# Altium schematic sheet SmartDevice.SchDoc
size A
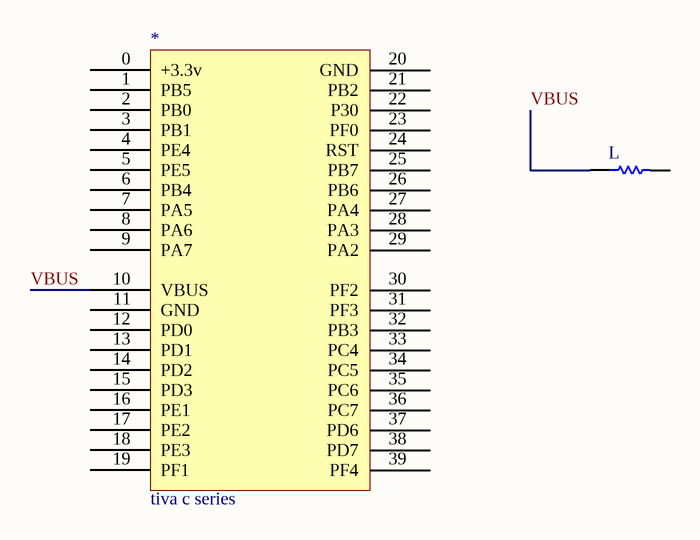
[diagram p0: SmartDevice.SchDoc]

## Parts
*  tiva c series
L  RESISTOR  [RES 1/2W]  (value not drawn)

## Nets
VBUS: *.10(VBUS) L.1

Not connected (* = marked no-connect by the designer): * 0(+3.3v) 1(PB5) 2(PB0) 3(PB1) 4(PE4) 5(PE5) 6(PB4) 7(PA5) 8(PA6) 9(PA7) 11(GND) 12(PD0) 13(PD1) 14(PD2) 15(PD3) 16(PE1) 17(PE2) 18(PE3) 19(PF1) 20(GND) 21(PB2) 22(P30) 23(PF0) 24(RST) 25(PB7) 26(PB6) 27(PA4) 28(PA3) 29(PA2) 30(PF2) 31(PF3) 32(PB3) 33(PC4) 34(PC5) 35(PC6) 36(PC7) 37(PD6) 38(PD7) 39(PF4); L 2